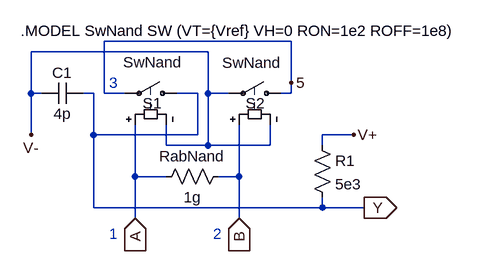
[diagram p0: schematic Nand.asc]
Nand.asc, the LTspice schematic file:
Version 4
SHEET 1 880 680
WIRE -160 224 -160 160
WIRE -160 288 -160 224
WIRE -144 224 -160 224
WIRE -64 224 -80 224
WIRE -64 288 -64 224
WIRE -64 400 -64 288
WIRE -48 224 -48 144
WIRE -16 224 -48 224
WIRE 0 352 0 272
WIRE 0 416 0 352
WIRE 48 304 48 272
WIRE 48 352 0 352
WIRE 96 224 64 224
WIRE 96 288 -64 288
WIRE 96 288 96 224
WIRE 112 160 -160 160
WIRE 112 224 112 160
WIRE 112 304 48 304
WIRE 112 304 112 224
WIRE 144 224 112 224
WIRE 160 352 128 352
WIRE 160 352 160 272
WIRE 160 416 160 352
WIRE 208 304 112 304
WIRE 208 304 208 272
WIRE 240 144 -48 144
WIRE 240 208 240 144
WIRE 240 224 224 224
WIRE 240 224 240 208
WIRE 288 304 288 288
WIRE 288 400 -64 400
WIRE 288 400 288 384
WIRE 336 288 288 288
WIRE 352 400 288 400
FLAG 352 400 Y
IOPIN 352 400 Out
FLAG 0 416 A
IOPIN 0 416 In
FLAG 160 416 B
IOPIN 160 416 In
FLAG -160 288 V-
FLAG 336 288 V+
FLAG 240 208 5
SYMBOL sw 80 224 M270
WINDOW 0 -15 39 VRight 0
WINDOW 3 48 8 VRight 0
SYMATTR InstName S1
SYMATTR Value SwNand
SYMBOL sw 240 224 M270
WINDOW 0 -15 41 VRight 0
WINDOW 3 47 15 VRight 0
SYMATTR InstName S2
SYMATTR Value SwNand
SYMBOL res 32 368 R270
WINDOW 0 32 56 VTop 0
WINDOW 3 0 56 VBottom 0
SYMATTR InstName RabNand
SYMATTR Value 1g
SYMBOL res 272 288 R0
SYMATTR InstName R1
SYMATTR Value 5e3
SYMBOL cap -80 208 R90
WINDOW 0 0 32 VBottom 0
WINDOW 3 32 32 VTop 0
SYMATTR InstName C1
SYMATTR Value 4p
TEXT -40 440 Left 0 ;1
TEXT 120 440 Left 0 ;2
TEXT -176 128 Left 0 !.MODEL SwNand SW (VT={Vref} VH=0 RON=1e2 ROFF=1e8)
TEXT -40 208 Left 0 ;3

The netlist it stands for:
* Nand.asc
S1 Y 5 A V- SwNand
S2 5 V- B V- SwNand
RabNand A B 1g
R1 V+ Y 5e3
C1 Y V- 4p
* 1
* 2
.MODEL SwNand SW (VT={Vref} VH=0 RON=1e2 ROFF=1e8)
* 3
.backanno
.end